# Altium schematic sheet 驱动2.SchDoc
size A3
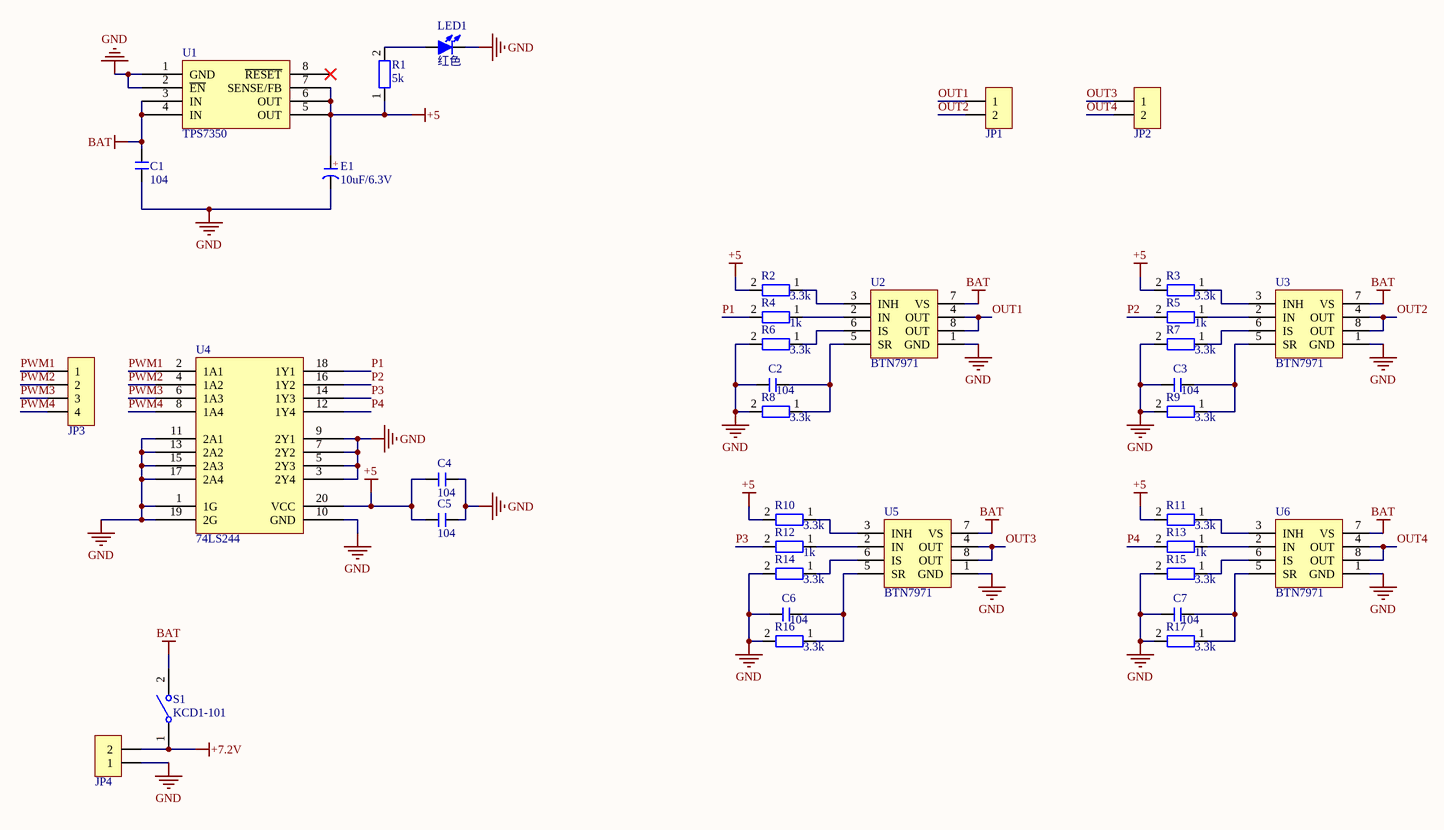
[diagram p0: 驱动2.SchDoc]

## Parts
C1  104  [C 0805_M]
C2  104  [C 0805_M]
C3  104  [C 0805_M]
C4  104  [C 0805_M]
C5  104  [C 0805_M]
C6  104  [C 0805_M]
C7  104  [C 0805_M]
E1  10uF/6.3V  [CD A(3216)]
JP1  HDR-1X2  [KF128-5.08-2P]  (value not drawn)
JP2  HDR-1X2  [KF128-5.08-2P]  (value not drawn)
JP3  HDR-1X4  [XH2.54-LI-4P]  (value not drawn)
JP4  HDR-1X2  [KF128-5.08-2P]  (value not drawn)
LED1  红色  [LED 0805G]
R1  5k  [R 0805_M]
R2  3.3k  [R 0805_M]
R3  3.3k  [R 0805_M]
R4  1k  [R 0805_M]
R5  1k  [R 0805_M]
R6  3.3k  [R 0805_M]
R7  3.3k  [R 0805_M]
R8  3.3k  [R 0805_M]
R9  3.3k  [R 0805_M]
R10  3.3k  [R 0805_M]
R11  3.3k  [R 0805_M]
R12  1k  [R 0805_M]
R13  1k  [R 0805_M]
R14  3.3k  [R 0805_M]
R15  3.3k  [R 0805_M]
R16  3.3k  [R 0805_M]
R17  3.3k  [R 0805_M]
S1  KCD1-101  [KCD1-101]
U1  TPS7350  [SOP8]
U2  BTN7971  [DPAK127P1615X127-8N]
U3  BTN7971  [DPAK127P1615X127-8N]
U4  74LS244  [SOP20]
U5  BTN7971  [DPAK127P1615X127-8N]
U6  BTN7971  [DPAK127P1615X127-8N]

## Nets
+5: C4.1 C5.1 E1.1(A) R1.1 R2.2 R3.2 R10.2 R11.2 U1.5(OUT) U1.6(OUT) U1.7(SENSE/FB) U4.20(VCC)
+7.2V: JP4.2 S1.1
BAT: C1.2 S1.2 U1.3(IN) U1.4(IN) U2.7(VS) U3.7(VS) U5.7(VS) U6.7(VS)
GND: C1.1 C2.2 C3.2 C4.2 C5.2 C6.2 C7.2 E1.2(K) JP4.1 LED1.2(K) R6.2 R7.2 R8.2 R9.2 R14.2 R15.2 R16.2 R17.2 U1.1(GND) U1.2(~{EN}) U2.1(GND) U3.1(GND) U4.1(1G) U4.3(2Y4) U4.5(2Y3) U4.7(2Y2) U4.9(2Y1) U4.10(GND) U4.11(2A1) U4.13(2A2) U4.15(2A3) U4.17(2A4) U4.19(2G) U5.1(GND) U6.1(GND)
OUT1: JP1.1 U2.4(OUT) U2.8(OUT)
OUT2: JP1.2 U3.4(OUT) U3.8(OUT)
OUT3: JP2.1 U5.4(OUT) U5.8(OUT)
OUT4: JP2.2 U6.4(OUT) U6.8(OUT)
P1: R4.2 U4.18(1Y1)
P2: R5.2 U4.16(1Y2)
P3: R12.2 U4.14(1Y3)
P4: R13.2 U4.12(1Y4)
PWM1: JP3.1 U4.2(1A1)
PWM2: JP3.2 U4.4(1A2)
PWM3: JP3.3 U4.6(1A3)
PWM4: JP3.4 U4.8(1A4)
NetC2_1: C2.1 R8.1 U2.5(SR)
NetC3_1: C3.1 R9.1 U3.5(SR)
NetC6_1: C6.1 R16.1 U5.5(SR)
NetC7_1: C7.1 R17.1 U6.5(SR)
NetLED1_1: LED1.1(A) R1.2
NetR2_1: R2.1 U2.3(INH)
NetR3_1: R3.1 U3.3(INH)
NetR4_1: R4.1 U2.2(IN)
NetR5_1: R5.1 U3.2(IN)
NetR6_1: R6.1 U2.6(IS)
NetR7_1: R7.1 U3.6(IS)
NetR10_1: R10.1 U5.3(INH)
NetR11_1: R11.1 U6.3(INH)
NetR12_1: R12.1 U5.2(IN)
NetR13_1: R13.1 U6.2(IN)
NetR14_1: R14.1 U5.6(IS)
NetR15_1: R15.1 U6.6(IS)

Not connected (* = marked no-connect by the designer): U1 8(~{RESET})*

## Notes on the sheet
- (in symbol C-CD) +

## Library data of the parts
C1-C7 = C: 无极性贴片电容; 版权归属: 源创客; BOM名称: 无极性贴片电容; 学习资源: www.ooocke.com
E1 = C-CD: 贴片钽电容; 版权归属: 源创客; BOM名称: 贴片钽电容; 学习资源: www.ooocke.com
JP1 JP2 JP4 = Header 2: 2P接插件; 版权归属: 源创客; BOM名称: 2P接插件; 学习资源: www.ooocke.com
JP3 = Header 4: 4P接插件; 版权归属: 源创客; BOM名称: 4P接插件; 学习资源: www.ooocke.com
LED1 = LED-SMD: 贴片LED; 版权归属: 源创客; BOM名称: 贴片LED; 学习资源: www.ooocke.com
R1-R17 = R: 贴片电阻; 版权归属: 源创客; BOM名称: 贴片电阻; 学习资源: www.ooocke.com
S1 = KCD1-101: 1路单刀船型开关; 版权归属: 源创客; BOM名称: 1路单刀船型开关; 学习资源: www.ooocke.com
U1 = TPS7350: 稳压